# EasyEDA Pro project Excam多功能小相机.epro, board PCB1
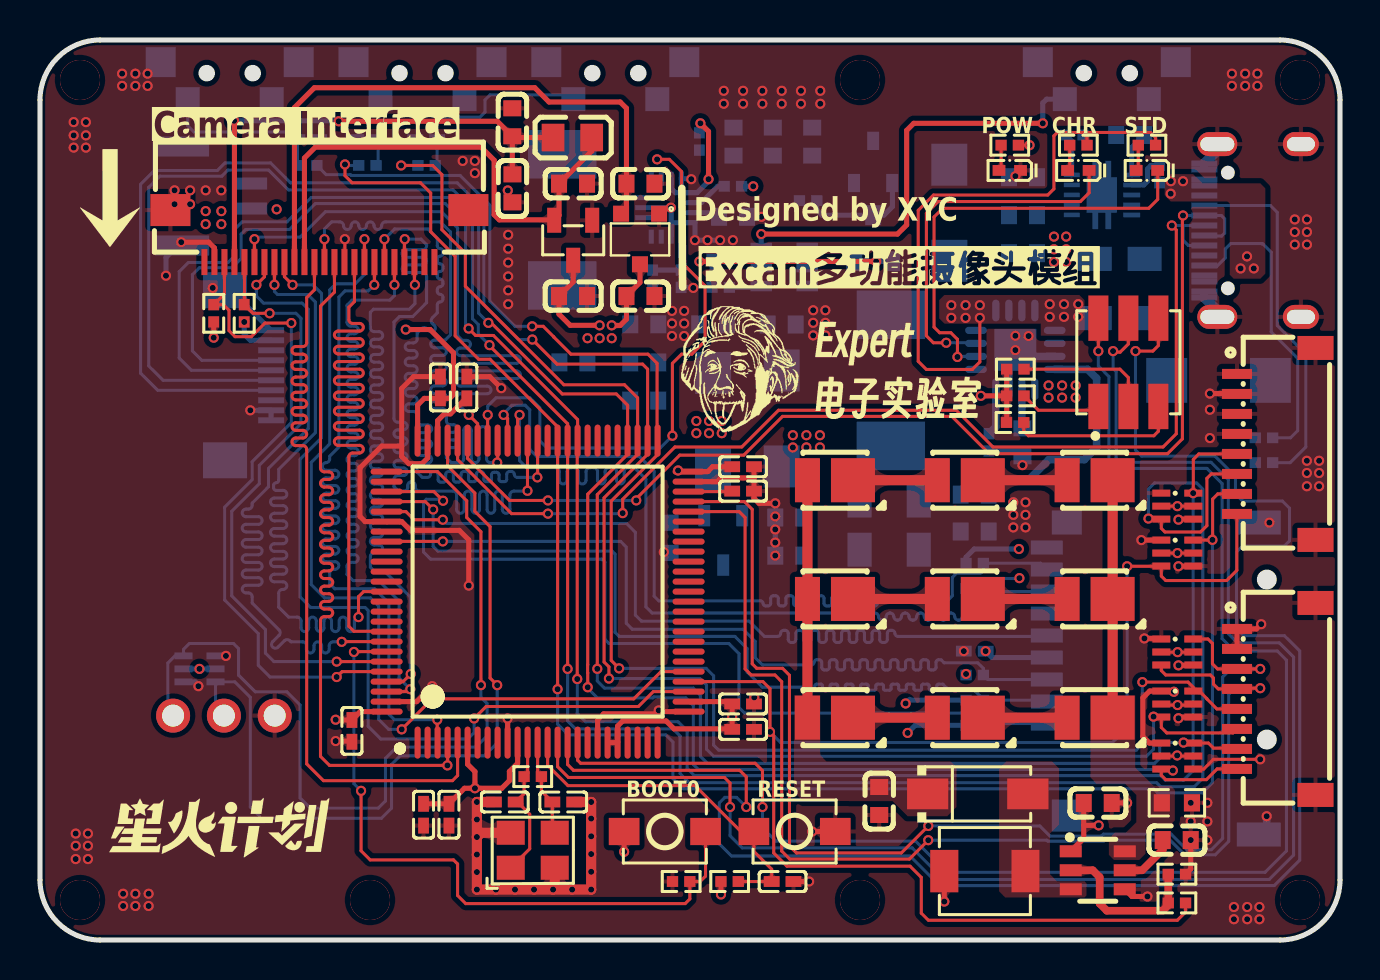
[diagram p4: board, top side]
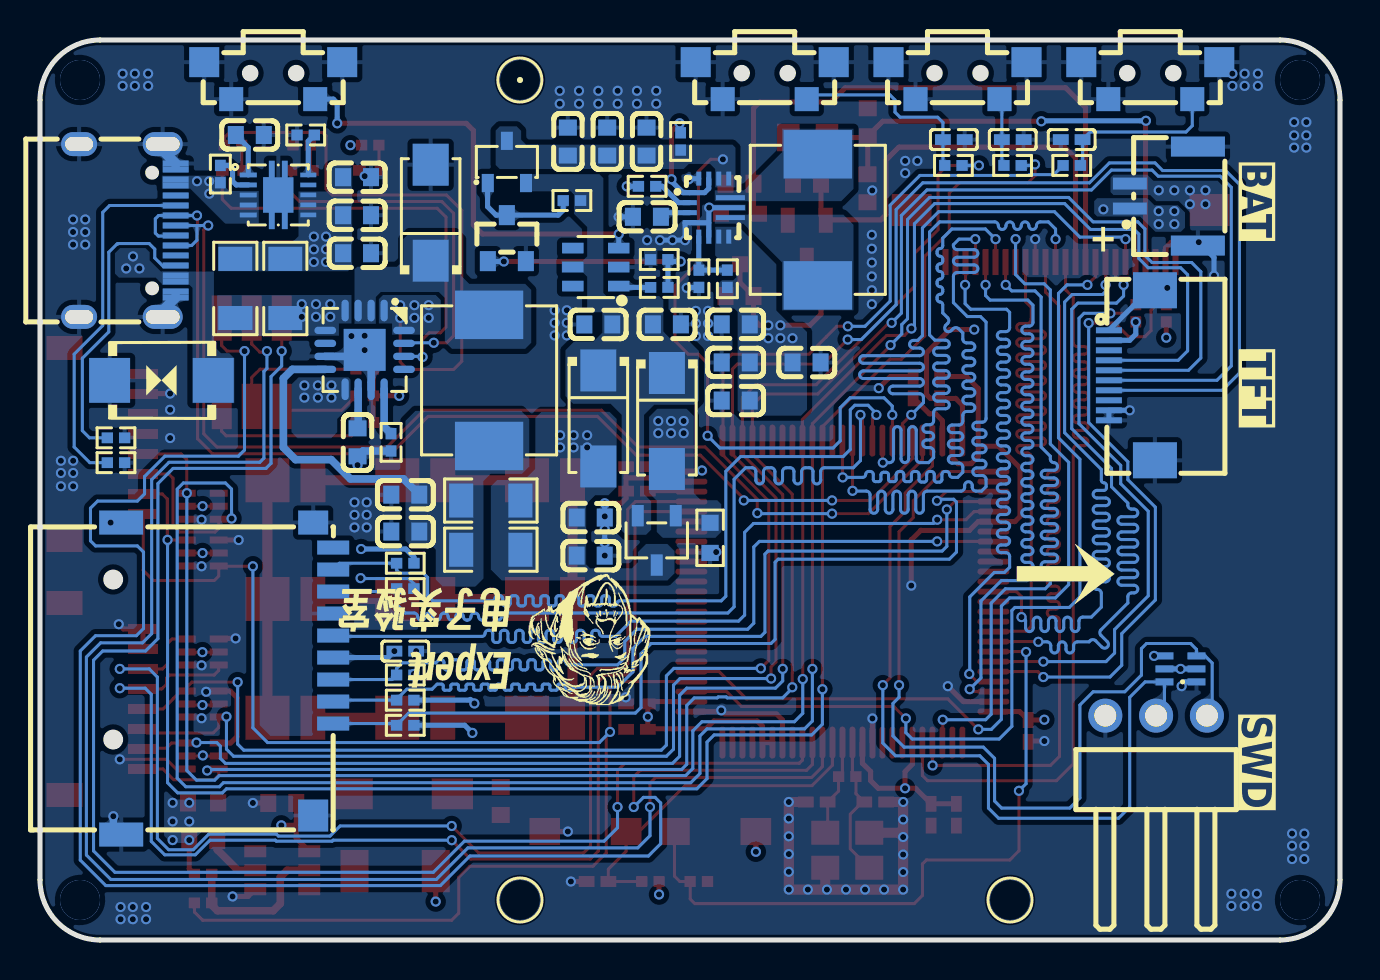
[diagram p5: board, bottom side, seen from below]

Outline 65 x 45 mm; copper layers: Top Layer, Inner1, Inner2, Bottom Layer. Coordinates in mm from the lower left corner of the outline.
Outline path: 0,42 0,3 arc(0.88,0.88) 3,0 62,0 arc(64.12,0.88) 65,3 65,42 arc(64.12,44.12) 62,45 3,45 arc(0.88,44.12) 0,42
Stack: Top Layer 0.035mm 外层铜厚1oz / Dielectric1 0.2104mm 7628 RC49% 8.6mil / Inner1 0.0152mm 内层铜厚 / Dielectric2 1.065mm 1.1mm H/HOZ Copper / Inner2 0.0152mm 内层铜厚 / Dielectric3 0.2104mm 7628 RC49% 8.6mil / Bottom Layer 0.035mm 外层铜厚1oz

## Design rules (mm)
net PA12: DP1
net PA11: DP1
template: 自定义配置
spacing copperThickness1oz (default): track to track 0.102, other pairs 0.152 to 0.3
spacing copperThickness2oz: track to track 0.203, other pairs 0.152 to 0.3
track width copperThickness1oz (default): min 0.127, default 0.152, max 2.54
track width copperThickness2oz: min 0.203, default 0.254, max 2.54
differential pair differentialPair (default): width min 0.127, default 0.254, max 2.54; gap min 0.152, default 0.152
via viaSize (default): diameter min 0.5, default 0.508, max 10; hole min 0.3, default 0.305, max 6.3

## Placement (name value [footprint] x y rotation side)
C1  4.7uF  [C0603]  52.89 6.85 180 top
C2  1uF  [C0603]  26.65 37.82 180 top
C3  1uF  [C0603]  41.96 6.95 90 top
C4  1uF  [C0603]  30.02 32.2 180 top
C5  1uF  [C0603]  26.65 32.2 180 top
C6  1uF  [C0603]  30.02 37.82 180 top
C8  10uF  [C0603]  23.62 37.58 90 top
C9  100nF  [C0603]  23.62 40.89 270 top
C114  100pF/NC  [C0603]  54.51 40.25 180 bottom
C115  10uF  [C0603]  46.74 20.42 0 bottom
C116  0.1uF  [C0603]  46.74 22.27 0 bottom
C117  10uF  [C0603]  49.15 36.24 0 bottom
C118  0.1uF  [C0603]  49.15 34.34 0 bottom
C119  10uF  [C0603]  49.15 38.14 0 bottom
C120  10uF  [C0603]  37.47 19.22 0 bottom
C121  0.1uF  [C0603]  37.46 21.12 0 bottom
C122  0.1uF  [C0603]  49.12 24.88 90 bottom
C136  10uF  [C0603]  36.64 39.92 270 bottom
C137  10uF  [C0603]  38.61 39.92 270 bottom
C138  10uF  [C0603]  34.67 39.92 270 bottom
C139  0.1uF  [C0603]  34.65 36.16 0 bottom
C140  10uF  [C0603]  30.21 26.97 180 bottom
C149  22uF  [C0603]  30.21 30.78 180 bottom
C150  22uF  [C0603]  26.67 28.88 0 bottom
C151  22uF  [C0603]  30.21 28.88 180 bottom
C152  100nF  [C0402]  19.18 6.27 270 top
C153  100nF  [C0402]  20.45 6.27 270 top
C154  100nF  [C0402]  35.15 11.8 0 top
C155  100nF  [C0402]  35.15 10.53 0 top
C156  2.2uF  [C0402]  35.15 22.44 180 top
C157  100nF  [C0402]  35.15 23.66 0 top
C158  22pF  [C0402]  23.24 6.9 0 top
C159  22pF  [C0402]  26.16 6.9 180 top
C160  1uF  [C0402]  37.13 2.92 180 top
C161  10uF  [C0603]  37.08 30.78 180 bottom
C162  0.1uF  [C0603]  33.66 30.78 0 bottom
C163  2.2uF  [C0402]  21.34 27.63 90 top
C164  100nF  [C0402]  20.02 27.63 90 top
C165  100nF  [C0402]  15.6 10.46 270 top
C166  100nF  [C0402]  46.74 14.44 0 bottom
C167  220nF  [C0603]  56.84 5 180 top
C168  1uF  [C0402]  13.42 40.02 180 bottom
C169  1uF  [C0402]  16.36 40.02 0 bottom
C170  1uF  [C0402]  19.31 40.02 0 bottom
CARD2  TF-012D  [TF-SMD_TF-012]  55.64 13.07 270 bottom
D1  SS54  [SMA_L4.4-W2.8-LS5.4-R-RD]  46.89 7.31 0 top
D22  SMBJ6.0CA  [SMB_L4.6-W3.6-LS5.3-BI]  58.93 27.98 180 bottom
FPC2  AFC01-S24FCA-00  [FPC-SMD_P0.50-24P_FGS-XJ-H2.0]  13.97 35.2 0 top
FPC4  F-FPC0M10P-C310  [FPC-SMD_P0.50-10P_FGS]  10.4 28.24 90 bottom
H3  KH-2.54PH90-1X3P-L13.8  [HDR-TH_3P-P2.54-H-M-W10.4-N]  9.19 11.22 180 bottom
L5  10uH  [IND-SMD_L7.3-W6.6]  42.54 27.98 270 bottom
L7  1.5uH  [IND-SMD_L7.3-W6.6]  26.11 36.01 90 bottom
L8  10uH  [IND-SMD_L4.4-W4.2]  47.24 3.45 0 top
L10  MPZ2012S300ATD25  [L0805]  26.62 40.12 180 top
LED1  LT2835WDT-6070-BKS  [LED-SMD_L3.5-W2.8-RD-A]  39.51 22.99 180 top
LED2  TC5050RGBF08-3CJH-AF53A  [LED-SMD_6P-L5.0-W5.0-TL_TC5050RGBF08]  54.42 28.88 90 top
LED5  LT2835WDT-6070-BKS  [LED-SMD_L3.5-W2.8-RD-A]  46 17.05 180 top
LED6  LT2835WDT-6070-BKS  [LED-SMD_L3.5-W2.8-RD-A]  52.49 17.05 180 top
LED7  LT2835WDT-6070-BKS  [LED-SMD_L3.5-W2.8-RD-A]  39.51 11.12 180 top
LED8  LT2835WDT-6070-BKS  [LED-SMD_L3.5-W2.8-RD-A]  46 11.12 180 top
LED9  -  [LED_0402]  55.35 38.48 180 top
LED10  -  [LED_0402]  51.92 38.48 180 top
LED11  -  [LED_0402]  48.49 38.48 180 top
LED12  LT2835WDT-6070-BKS  [LED-SMD_L3.5-W2.8-RD-A]  46 22.99 180 top
LED13  LT2835WDT-6070-BKS  [LED-SMD_L3.5-W2.8-RD-A]  52.49 22.99 180 top
LED14  LT2835WDT-6070-BKS  [LED-SMD_L3.5-W2.8-RD-A]  52.49 11.12 180 top
LED15  LT2835WDT-6070-BKS  [LED-SMD_L3.5-W2.8-RD-A]  39.51 17.05 180 top
Q1  -  [S8050_SOT-23]  41.78 35.09 270 bottom
Q3  AO3401  [SOT-23-3_L2.9-W1.4-P1.90-LS2.6-BR]  41.66 38.9 270 bottom
R1  1.1R  [R0603]  56.84 6.86 180 top
R111  1M  [R0402]  55.98 38.3 90 bottom
R112  100K  [R0402]  51.71 40.25 0 bottom
R113  5K  [R0402]  51.92 39.74 0 top
R114  5K  [R0402]  55.35 39.74 0 top
R115  320K  [R0402]  47.45 24.88 270 bottom
R116  0.4Ω  [R1206]  42.46 21.97 180 bottom
R117  0.4Ω  [R1206]  42.46 19.51 180 bottom
R119  10K  [R0402]  32.97 39.93 270 bottom
R120  100K  [R0402]  34.65 37.69 180 bottom
R121  150K  [R0402]  32.06 33.06 270 bottom
R122  470K  [R0402]  30.63 33.06 90 bottom
R125  10K  [R0603]  31.5 20.11 90 bottom
R126  2K  [R0402]  48.49 39.74 0 top
R128  0.4  [R1206]  52.74 32.58 270 bottom
R129  0.4  [R1206]  55.23 32.58 270 bottom
R130  1M  [R0402]  24.64 8.17 180 top
R131  10K  [R0402]  34.48 2.92 180 top
R132  10K  [R0402]  32.06 2.92 0 top
R135  470  [R0402]  48.77 27.21 180 top
R136  470  [R0402]  48.77 28.54 180 top
R137  470  [R0402]  48.76 25.88 180 top
R139  1K  [R0402]  34.04 32.63 180 bottom
R140  100K  [R0402]  34.04 34.03 0 bottom
R141  100K  [R0402]  38.41 36.97 180 bottom
R142  5.1K  [R0402]  61.2 23.87 180 bottom
R143  5.1K  [R0402]  61.2 25.11 180 bottom
R144  10K  [R0402]  46.74 18.84 180 bottom
R145  10K  [R0402]  46.74 17.57 180 bottom
R146  10K  [R0402]  46.74 13.25 180 bottom
R147  10K  [R0402]  46.74 11.99 180 bottom
R148  10K  [R0402]  46.74 10.74 180 bottom
R151  4.7K  [R0402]  8.69 31.33 270 top
R152  4.7K  [R0402]  10.21 31.33 270 top
R156  0  [R0402]  56.84 1.85 0 top
R157  10K  [R0402]  56.84 3.29 0 top
R159  0  [R0402]  13.41 38.73 0 bottom
R160  0  [R0402]  16.37 38.73 180 bottom
R161  0  [R0402]  19.33 38.73 180 bottom
SW1  按键3X6侧按键(带定位柱)  [SW-SMD_L7.0-W3.5-P4.20_C9900005441]  53.34 42.97 180 bottom
SW2  轻触按键3*4*H  [SW-SMD_L4.0-W2.9-LS5.0]  31.24 5.42 0 top
SW3  轻触按键3*4*H  [SW-SMD_L4.0-W2.9-LS5.0]  37.73 5.42 0 top
SW7  按键3X6侧按键(带定位柱)  [SW-SMD_L7.0-W3.5-P4.20_C9900005441]  9.49 42.97 180 bottom
SW8  按键3X6侧按键(带定位柱)  [SW-SMD_L7.0-W3.5-P4.20_C9900005441]  19.12 42.97 180 bottom
SW9  按键3X6侧按键(带定位柱)  [SW-SMD_L7.0-W3.5-P4.20_C9900005441]  28.76 42.97 180 bottom
U1  XC6206P282MR  [SOT-23-3_L2.9-W1.3-P1.90-LS2.4-BR]  26.66 34.99 90 top
U2  STM32H743VIT6  [LQFP-100_L14.0-W14.0-P0.50-LS16.0-BL]  24.88 17.42 0 top
U3  SS54  [SMA_L4.2-W2.6-LS5.1-RD]  33.66 25.95 270 bottom
U71  BAV99S  [SOT-363-6_L2.0-W1.3-P0.65-LS2.1-BL]  56.87 9.2 270 top
U83  BAV99S  [SOT-363-6_L2.0-W1.3-P0.65-LS2.1-BL]  56.87 14.4 270 top
U84  BAV99S  [SOT-363-6_L2.0-W1.3-P0.65-LS2.1-BL]  56.87 11.8 270 top
U85  BAV99S  [SOT-363-6_L2.0-W1.3-P0.65-LS2.1-BL]  56.87 19.35 270 top
U86  BAV99S  [SOT-363-6_L2.0-W1.3-P0.65-LS2.1-BL]  56.87 21.69 270 top
U95  TPS259261DRCR  [VSON-10_L3.0-W3.0-P0.50-TL-EP_TPS62410DRCR]  53.09 37.25 180 bottom
U96  TP5100  [TQFN-16_L4.0-W4.0-P0.65-BL-EP]  48.77 29.51 0 bottom
U98  AO3401  [SOT-23-3_L2.9-W1.6-P1.90-LS2.8-BR]  34.16 19.98 90 bottom
U99  SS54  [SMA_L4.2-W2.6-LS5.1-RD]  45.47 36.36 90 bottom
U100  SS54  [SMA_L4.2-W2.6-LS5.1-RD]  37.08 26.08 270 bottom
U101  TPS63070RNMR  [VQFN-HR-15_L3.0-W2.5-P0.50-BL_TPS63070RNMR]  31.5 36.62 270 bottom
U104  EC190708- 15FF-1925  [SOT-23-6_L2.9-W1.6-P0.95-LS2.9-BL]  37.21 33.65 90 bottom
U106  XC6206P182MR  [SOT-23-3L_L2.9-W1.6-P1.90-LS2.8-BL]  30 35.05 180 top
U108  SH1.0MM-8P-W  [CONN-SMD_8P-SH1.0MM-8P-W]  61.81 12.05 90 top
U109  SH1.0MM-8P-W  [CONN-SMD_8P-SH1.0MM-8P-W]  61.81 24.8 90 top
U110  TPS61165DBVR  [SOT-23-6_L2.9-W1.6-P0.95-LS2.8-BR]  52.89 3.49 180 top
U111  GH1.25-2P卧贴  [CONN-SMD_2P-P1.25_GH1.25-2P]  8.81 37.2 90 bottom
U112  BAV99S  [SOT-363-6_L2.0-W1.3-P0.65-LS2.1-BL]  7.98 13.56 90 bottom
USB2  KH-TYPE-C-16P  [USB-C-SMD_KH-TYPE-C-16P]  60.63 35.47 270 bottom
X1  12MHz  [OSC-SMD_4P-L3.2-W2.5-BL]  24.64 4.49 0 top

## Footprints (pads in the part's own frame, mm; a bottom-side part is the same pattern mirrored in y, then rotated)
C0402
  rect 0.79x0.54 smd: 1(-0.545,0) 2(0.545,0)
C0603
  rect 0.8x0.9 smd: 1(-0.7,0) 2(0.7,0)
CONN-SMD_2P-P1.25_GH1.25-2P
  rect 0.6x1.7 smd: 1(-0.625,1.702) 2(0.625,1.702)
  rect 1x2.7 smd: 3(2.475,-1.702) 4(-2.475,-1.698)
CONN-SMD_8P-SH1.0MM-8P-W
  rect 1.2x1.8 smd: 0(-4.799,-1.962) 0(4.799,-1.962)
  rect 0.5x1.5 smd: 1(3.5,1.962) 2(2.5,1.962) 3(1.5,1.962) 4(0.5,1.962) 5(-0.5,1.962) 6(-1.5,1.962) 7(-2.5,1.962) 8(-3.5,1.962)
FPC-SMD_P0.50-10P_FGS
  rect 0.3x1.3 smd: 1(2.25,1.149) 2(1.748,1.151) 3(1.248,1.151) 4(0.748,1.151) 5(0.248,1.151) 6(-0.252,1.151) 7(-0.752,1.151) 8(-1.252,1.151) 9(-1.752,1.151) 10(-2.252,1.151)
  rect 1.8x2.2 smd: 11(-4.25,-1.151) 12(4.25,-1.151)
FPC-SMD_P0.50-24P_FGS-XJ-H2.0
  rect 0.3x1.3 smd: 1(-5.748,-1.3) 2(-5.248,-1.3) 3(-4.748,-1.3) 4(-4.248,-1.3) 5(-3.748,-1.3) 6(-3.248,-1.3) 7(-2.748,-1.3) 8(-2.248,-1.3) 9(-1.748,-1.3) 10(-1.248,-1.3) 11(-0.748,-1.3) 12(-0.248,-1.3) 13(0.252,-1.3) 14(0.752,-1.3) 15(1.252,-1.3) 16(1.752,-1.3) 17(2.252,-1.3) 18(2.752,-1.3) 19(3.252,-1.3) 20(3.752,-1.3) 21(4.252,-1.3) 22(4.752,-1.3) 23(5.252,-1.3) 24(5.752,-1.3)
  rect 2x1.6 smd: 25(7.45,1.3) 26(-7.45,1.3)
HDR-TH_3P-P2.54-H-M-W10.4-N
  round 1.7 hole 1.1: 1(-2.54,0) 2(0,0) 3(2.54,0)
IND-SMD_L4.4-W4.2
  rect 1.4x2.12 smd: 1(2.028,0) 2(-2.028,0)
IND-SMD_L7.3-W6.6
  rect 2.424x3.42 smd: 1(3.278,0) 2(-3.278,0)
L0805
  rect 1.133x1.377 smd: 1(-0.966,0) 2(0.966,0)
LED-SMD_6P-L5.0-W5.0-TL_TC5050RGBF08
  rect 2.265x1 smd: 1(-2.208,1.5) 2(-2.208,0) 3(-2.208,-1.5) 4(2.208,-1.5) 5(2.208,0) 6(2.208,1.5)
LED-SMD_L3.5-W2.8-RD-A
  rect 2.2x2.2 smd: 1(-1.137,0)
  rect 1.25x2.2 smd: 2(1.137,0)
LED_0402
  rect 0.637x0.541 smd: 1(-0.538,0) 2(0.538,0)
LQFP-100_L14.0-W14.0-P0.50-LS16.0-BL
  oval 0.3x1.6 smd: 1(-6,-7.55) 2(-5.5,-7.55) 3(-5,-7.55) 4(-4.5,-7.55) 5(-4,-7.55) 6(-3.5,-7.55) 7(-3,-7.55) 8(-2.5,-7.55) 9(-2,-7.55) 10(-1.5,-7.55) 11(-1,-7.55) 12(-0.5,-7.55) 13(0,-7.55) 14(0.5,-7.55) 15(1,-7.55) 16(1.5,-7.55) 17(2,-7.55) 18(2.5,-7.55) 19(3,-7.55) 20(3.5,-7.55) 21(4,-7.55) 22(4.5,-7.55) 23(5,-7.55) 24(5.5,-7.55) 25(6,-7.55) 51(6,7.55) 52(5.5,7.55) 53(5,7.55) 54(4.5,7.55) 55(4,7.55) 56(3.5,7.55) 57(3,7.55) 58(2.5,7.55) 59(2,7.55) 60(1.5,7.55) 61(1,7.55) 62(0.5,7.55) 63(0,7.55) 64(-0.5,7.55) 65(-1,7.55) 66(-1.5,7.55) 67(-2,7.55) 68(-2.5,7.55) 69(-3,7.55) 70(-3.5,7.55) 71(-4,7.55) 72(-4.5,7.55) 73(-5,7.55) 74(-5.5,7.55) 75(-6,7.55)
  oval 1.6x0.3 smd: 26(7.55,-6) 27(7.55,-5.5) 28(7.55,-5) 29(7.55,-4.5) 30(7.55,-4) 31(7.55,-3.5) 32(7.55,-3) 33(7.55,-2.5) 34(7.55,-2) 35(7.55,-1.5) 36(7.55,-1) 37(7.55,-0.5) 38(7.55,0) 39(7.55,0.5) 40(7.55,1) 41(7.55,1.5) 42(7.55,2) 43(7.55,2.5) 44(7.55,3) 45(7.55,3.5) 46(7.55,4) 47(7.55,4.5) 48(7.55,5) 49(7.55,5.5) 50(7.55,6) 76(-7.55,6) 77(-7.55,5.5) 78(-7.55,5) 79(-7.55,4.5) 80(-7.55,4) 81(-7.55,3.5) 82(-7.55,3) 83(-7.55,2.5) 84(-7.55,2) 85(-7.55,1.5) 86(-7.55,1) 87(-7.55,0.5) 88(-7.55,0) 89(-7.55,-0.5) 90(-7.55,-1) 91(-7.55,-1.5) 92(-7.55,-2) 93(-7.55,-2.5) 94(-7.55,-3) 95(-7.55,-3.5) 96(-7.55,-4) 97(-7.55,-4.5) 98(-7.55,-5) 99(-7.55,-5.5) 100(-7.55,-6)
OSC-SMD_4P-L3.2-W2.5-BL
  rect 1.4x1.2 smd: 1(-1.1,-0.875) 2(1.1,-0.875) 3(1.1,0.875) 4(-1.1,0.875)
R0402
  rect 0.566x0.54 smd: 1(-0.433,0) 2(0.433,0)
R0603
  rect 0.806x0.864 smd: 1(-0.753,0) 2(0.753,0)
R1206
  rect 1.208x1.701 smd: 1(-1.479,0) 2(1.479,0)
S8050_SOT-23
  rect 1x0.8 smd: 1(1.15,-0.823) 2(1.15,1.077) 3(-1.15,0.127)
SMA_L4.2-W2.6-LS5.1-RD
  rect 2.1x1.8 smd: 1(-2.4,0) 2(2.4,0)
SMA_L4.4-W2.8-LS5.4-R-RD
  rect 2.062x1.539 smd: 1(2.503,0) 2(-2.503,0)
SMB_L4.6-W3.6-LS5.3-BI
  rect 2.047x2.241 smd: 1(-2.591,0) 2(2.591,0)
SOT-23-3_L2.9-W1.3-P1.90-LS2.4-BR
  rect 1.25x0.7 smd: 1(1,-0.95) 2(1,0.95) 3(-1,0)
SOT-23-3_L2.9-W1.4-P1.90-LS2.6-BR
  rect 0.91x0.6 smd: 1(1.055,-0.955) 2(1.055,0.955) 3(-1.055,0)
SOT-23-3_L2.9-W1.6-P1.90-LS2.8-BR
  rect 1.07x0.6 smd: 1(1.235,-0.95) 2(1.235,0.95) 3(-1.235,0)
SOT-23-3L_L2.9-W1.6-P1.90-LS2.8-BL
  rect 0.8x0.8 smd: 1(-0.95,-1.265) 2(0.95,-1.265) 3(0.005,1.265)
SOT-23-6_L2.9-W1.6-P0.95-LS2.8-BR
  rect 1.1x0.6 smd: 1(1.35,-0.95) 2(1.35,0) 3(1.35,0.95) 4(-1.35,0.95) 5(-1.35,0) 6(-1.35,-0.95)
SOT-23-6_L2.9-W1.6-P0.95-LS2.9-BL
  rect 0.532x1.072 smd: 1(-0.95,-1.149) 2(0,-1.149) 3(0.95,-1.149) 4(0.95,1.149) 5(0,1.149) 6(-0.95,1.149)
SOT-363-6_L2.0-W1.3-P0.65-LS2.1-BL
  rect 0.35x0.9 smd: 1(-0.65,-0.8) 2(0,-0.8) 3(0.65,-0.8) 4(0.65,0.8) 5(0,0.8) 6(-0.65,0.8)
SW-SMD_L4.0-W2.9-LS5.0
  rect 1.53x1.36 smd: 1(-2.035,0) 2(2.035,0)
SW-SMD_L7.0-W3.5-P4.20_C9900005441
  rect 1.2x1.2 smd: 1(-2.1,-0.925) 2(2.1,-0.925)
  rect 1.5x1.5 smd: 3(-3.45,0.925) 4(3.45,0.925)
TF-SMD_TF-012
  rect 0.7x1.6 smd: 1(2.25,5.3) 2(1.15,5.3) 3(0.05,5.3) 4(-1.05,5.3) 5(-2.15,5.3) 6(-3.25,5.3) 7(-4.35,5.3) 8(-5.45,5.3) CD(-6.55,5.3)
  rect 1.2x1.5 smd: 10(-7.8,4.3)
  rect 1.2x2.2 smd: 11(-7.8,-5.3) 12(7.8,-5.3)
  rect 1.6x1.5 smd: 13(6.85,4.3)
TQFN-16_L4.0-W4.0-P0.65-BL-EP
  oval 0.364x1.087 smd: 1(-0.975,-1.968) 2(-0.325,-1.968) 3(0.325,-1.968) 4(0.975,-1.968) 9(0.975,1.968) 10(0.325,1.968) 11(-0.325,1.968) 12(-0.975,1.968)
  oval 1.087x0.364 smd: 5(1.968,-0.975) 6(1.968,-0.325) 7(1.968,0.325) 8(1.968,0.975) 13(-1.968,0.975) 14(-1.968,0.325) 15(-1.968,-0.325) 16(-1.968,-0.975)
  rect 2.1x2.1 smd: 17(0,0)
USB-C-SMD_KH-TYPE-C-16P
  oval 1.2x2 hole 0.7x1.7: 1(-4.32,1.765) 2(4.32,1.765)
  oval 1.2x1.8 hole 0.7x1.4: 3(-4.32,-2.415) 4(4.32,-2.415)
  rect 0.3x1.3 smd: A1(-3.35,2.415) A4(-2.55,2.415) A5(-1.25,2.415) A6(-0.25,2.415) A7(0.25,2.415) A8(1.25,2.415) A9(2.55,2.415) A12(3.35,2.415) B1(3.05,2.415) B4(2.25,2.415) B5(1.75,2.415) B6(0.75,2.415) B7(-0.75,2.415) B8(-1.75,2.415) B9(-2.25,2.415) B12(-3.05,2.415)
VQFN-HR-15_L3.0-W2.5-P0.50-BL_TPS63070RNMR
  rect 0.25x0.7 smd: 1(-0.75,-1.016) 2(-0.25,-1.016) 3(0.25,-1.016) 4(0.75,-1.016)
  rect 0.7x0.25 smd: 5(1.45,-0.566) 6(1.45,-0.066) 7(1.45,0.434) 8(1.45,0.934) 12(-1.45,0.934) 13(-1.45,0.434) 14(-1.45,-0.066) 15(-1.45,-0.566)
  rect 0.25x1.45 smd: 9(0.5,1.016) 11(-0.5,1.016)
  rect 0.25x1.85 smd: 10(0,0.817)
VSON-10_L3.0-W3.0-P0.50-TL-EP_TPS62410DRCR
  rect 0.85x0.24 smd: 1(-1.5,1) 2(-1.5,0.5) 3(-1.5,0) 4(-1.5,-0.5) 5(-1.5,-1)
  rect 0.8x0.23 smd: 6(1.5,-1) 7(1.5,-0.5) 8(1.5,0) 9(1.5,0.5) 10(1.5,1)
  custom 1.52x3.42 smd: 11(0,-0.005)

## Nets
1.8V: C6.2 FPC2.10 U106.2
2.8V-A: C8.2 C9.2 FPC2.4 L10.2
2.8V-D: C2.2 FPC2.11 L10.1 U1.2
3V3: C1.2 C4.2 C5.2 C140.2 C149.2 C150.2 C151.2 C152.1 C153.1 C154.1 C155.1 C157.1 C164.1 C165.1 C166.2 CARD2.4 FPC4.2 L8.2 R120.1 R122.1 R126.2 R131.2 R135.2 R136.2 R137.2 R144.2 R145.2 R146.2 R147.2 R148.2 R151.2 R152.2 SW2.1 U1.3 U2.6 U2.11 U2.20 U2.21 U2.27 U2.50 U2.75 U2.100 U71.2 U71.5 U83.2 U83.5 U84.2 U84.5 U85.2 U85.5 U86.2 U86.5 U101.7 U101.8 U106.3 U110.1 U112.2 U112.5
GND: C1.1 C2.1 C3.1 C4.1 C5.1 C6.1 C8.1 C9.1 C114.2 C115.2 C116.2 C117.1 C118.1 C119.1 C120.1 C121.1 C122.1 C136.1 C137.1 C138.1 C139.2 C140.1 C149.1 C150.1 C151.1 C152.2 C153.2 C154.2 C155.2 C156.1 C157.2 C158.1 C159.1 C160.1 C161.1 C162.1 C163.2 C164.2 C165.2 C166.1 C167.1 C168.1 C169.1 C170.1 CARD2.6 CARD2.10 CARD2.11 CARD2.12 CARD2.13 D22.1 FPC2.2 FPC2.15 FPC2.25 FPC2.26 FPC4.1 FPC4.9 FPC4.10 FPC4.11 FPC4.12 H3.1 LED11.1 Q1.2 R1.1 R112.2 R115.2 R121.2 R125.1 R132.1 R140.2 R142.2 R143.2 R157.2 SW1.1 SW1.3 SW1.4 SW3.2 SW7.1 SW7.3 SW7.4 SW8.1 SW8.3 SW8.4 SW9.1 SW9.3 SW9.4 U1.1 U2.10 U2.19 U2.26 U2.49 U2.74 U2.81 U2.99 U71.1 U71.4 U83.1 U83.4 U84.1 U84.4 U85.1 U85.4 U86.1 U86.4 U95.11 U96.7 U96.11 U96.17 U99.2 U101.4 U101.6 U101.10 U101.15 U104.2 U106.1 U108.0 U108.1 U108.2 U109.0 U109.1 U109.2 U109.3 U109.4 U110.4 U111.2 U111.3 U111.4 U112.1 U112.4 USB2.1 USB2.2 USB2.3 USB2.4 USB2.A1 USB2.A12 USB2.B1 USB2.B12 X1.2 X1.4
VBUS: C117.2 C118.2 C119.2 R125.2 R128.1 R129.1 U3.2 U95.6 U95.7 U95.8 U98.1
VIN: C136.2 C137.2 C138.2 Q3.3 R119.2 U2.68 U101.12 U101.13
VIN_BAT: C161.2 C162.2 Q3.2 R141.2 U3.1 U98.2 U100.1 U104.5
BAT: C120.2 C121.2 R116.2 R117.2 U96.9 U98.3 U100.2 U111.1
BOOT0: R132.2 SW2.2 U2.94
CC1: R142.1 USB2.A5
CC2: R143.1 USB2.B5
DAC: R156.2 U2.29 U85.3 U109.8
DCMI_CLK: FPC2.13 U2.67
DCMI_D0: FPC2.19 U2.63
DCMI_D1: FPC2.21 U2.64
DCMI_D2: FPC2.22 U2.97
DCMI_D3: FPC2.20 U2.98
DCMI_D4: FPC2.18 U2.3
DCMI_D5: FPC2.16 U2.92
DCMI_D6: FPC2.14 U2.4
DCMI_D7: FPC2.12 U2.5
DCMI_HSYNC: FPC2.9 U2.28
DCMI_PCLK: FPC2.17 U2.30
DCMI_PWDN: FPC2.8 U2.88
DCMI_RST: FPC2.6 U2.69
DCMI_VSYNC: FPC2.7 U2.93
I2C1_SCL: FPC2.5 R152.1 U2.95
I2C1_SDA: FPC2.3 R151.1 U2.96
I2C2_SCL: U2.46 U83.3 U108.4
I2C2_SDA: U2.47 U83.6 U108.3
IN: C3.2 D1.2 LED1.2 LED7.2 LED15.2
LED_B: LED2.6 U2.17
LED_G: LED2.4 U2.16
LED_R: LED2.5 U2.15
OSC_IN: C158.2 R130.2 U2.12 X1.1
OSC_OUT: C159.2 R130.1 U2.13 X1.3
OUT: LED6.1 LED13.1 LED14.1 R1.2 U110.6
PA11: U2.70 USB2.A7 USB2.B7
PA12: U2.71 USB2.A6 USB2.B6
PA13: H3.2 U2.72 U112.6
PA14: H3.3 U2.76 U112.3
PB12: R159.2 U2.51 U84.6 U108.5
PB13: FPC4.7 U2.52 U84.3 U108.6
PB14: R161.2 U2.53 U71.6 U108.7
PB15: FPC4.6 U2.54 U71.3 U108.8
PC8: CARD2.7 R145.1 U2.65
PC9: CARD2.8 R144.1 U2.66
PC10: CARD2.1 R148.1 U2.78
PC11: CARD2.2 R147.1 U2.79
PC12: CARD2.5 U2.80
PD2: CARD2.3 R146.1 U2.83
PD12: FPC4.4 U2.59 U86.6 U109.5
PD13: FPC4.5 U2.60 U86.3 U109.6
PD14: R160.2 U2.61 U85.6 U109.7
RESET: C160.2 R131.1 SW3.1 U2.14
USBVIN: D22.2 R111.1 U95.3 U95.4 U95.5 USB2.A4 USB2.A9 USB2.B4 USB2.B9
$1N3549: C163.1 U2.73
$1N3580: C156.2 U2.48
$1N3744: LED2.1 R135.1
$1N3745: LED2.2 R136.1
$1N3746: LED2.3 R137.1
$1N4459: R111.2 U95.2
$1N4460: C114.1 U95.1
$1N4462: R112.1 U95.10
$1N5190: LED10.1 U96.15
$1N5191: LED9.1 U96.14
$1N5192: LED10.2 R113.1
$1N5193: LED9.2 R114.1
$1N5198: L5.2 U96.2 U96.3 U99.1
$1N5199: C115.1 C116.1 L5.1 R116.1 R117.1 U96.8
$1N5204: R115.1 U96.12
$1N5206: C122.2 U96.10
$1N5210: R113.2 R114.2 R128.2 R129.2 U96.1 U96.4 U96.5 U96.16
$1N5785: L7.1 U101.11
$1N5786: L7.2 U101.9
$1N5790: R119.1 U101.1 U101.14
$1N5793: C139.1 U101.3
$1N5797: R120.2 U101.2
$1N5798: R121.1 R122.2 U101.5
$1N5799: LED11.2 R126.1
$1N7002: Q1.1 R139.2 R140.1
$1N7003: R139.1 U104.1
$1N7007: Q1.3 Q3.1 R141.1
$1N9964: SW1.2 U104.3
$1N32732: C167.2 U110.5
$1N32737: LED1.1 LED12.2
$1N32738: LED7.1 LED8.2
$1N32739: LED12.1 LED13.2
$1N32741: LED8.1 LED14.2
$1N32745: LED5.2 LED15.1
$1N32746: LED5.1 LED6.2
$1N39545: R156.1 R157.1 U110.2
$1N39592: D1.1 L8.1 U110.3
$1N42854: C168.2 R159.1 SW7.2
$1N42887: C169.2 R160.1 SW8.2
$1N42920: C170.2 R161.1 SW9.2

Pads without a net: CARD2 CD; FPC2 1 23 24; FPC4 3 8; U2 1 2 7 8 9 18 22 23 24 25 31 32 33 34 35 36 37 38 39 40 41 42 43 44 45 55 56 57 58 62 77 82 84 85 86 87 89 90 91; U95 9; U96 6 13; U104 4 6; USB2 A8 B8

## Via types
v1: diameter 2, hole 2, Top Layer to Bottom Layer, 7 vias
v2: diameter 0.508, hole 0.305, Top Layer to Bottom Layer, 336 vias

## Routing (per net, layer and track width the routed paths; a pad name or vN(x,y) marks a point on that pad's centre or on a via; arc(x,y) is an arc through that point)
1.8V: length 30.5
  Top Layer w0.254: FPC2.10 12.72,41.62 13.72,42.61 24.74,42.61 25.45,41.9 29.01,41.9 29.32,41.58 C6.2 29.32,36.58 U106.2
2.8V-A: length 25.3
  Top Layer w0.254: L10.2 23.68,40.12 C9.2 ; v2(14.94,40.94) 22.87,40.94 C9.2 ; C9.2 23.62,38.29 C8.2 ; FPC2.4 9.72,40.94 v2(9.7,40.96)
  Bottom Layer w0.254: v2(9.7,40.96) 14.91,40.96 v2(14.94,40.94)
2.8V-D: length 25.9
  Top Layer w0.254: 27.59,40.12 27.59,39.45 C2.2 25.95,36.23 U1.2 25.69,36.01 22.96,36.01 22.71,36.26 22.71,38.99 22.05,39.64 13.77,39.64 13.22,39.1 FPC2.11
3V3: length 82.8
  Top Layer w0.152: U83.2 56.07,14.39 v2(56.88,14.39) 57.66,14.39 U83.5 ; U86.2 U86.5 ; U71.2 U71.5 ; U84.5 57.62,11.75 v2(56.88,11.75) 56.12,11.75 U84.2 ; U85.5 v2(56.87,19.35) U85.2 ; R126.2 v2(49.48,39.74)
  Top Layer w0.254: v2(18.29,30.52) 19.51,30.52 20.68,29.35 20.68,27.27 20.49,27.08 C164.1 19.22,27.08 18.88,26.75 U2.75 ; U2.100 16.01,11.42 C165.1 14.8,11 v2(14.78,11.02) ; C1.2 52.19,5.75 ; 52.19,5.75 52.2,5.73 v2(52.93,5.73) ; 52.19,5.75 52.19,5.09 U110.1 ; U2.11 23.88,8.83 23.47,8.42 23.47,7.97 23.09,7.59 v2(21.75,7.59) ; v2(21.75,7.59) 21.22,7.59 C153.1 C152.1 ; v2(21.75,7.59) 21.75,8.42 21.38,8.79 U2.6 ; U2.20 U2.21 28.88,10.69 29.13,10.95 31.31,10.95 31.7,10.56 34.58,10.56 C155.1 v2(34.61,11.16) C154.1 34.49,11.92 U2.27 ; U106.3 30,32.87 C4.2 29.32,31.04 29.01,30.72 28.59,30.72 v2(28.59,30.73) ; R136.2 R135.2 ; R135.2 48.34,25.89 R137.2 ; R135.2 v2(47.04,27.21) ; R131.2 v2(34.05,2.28) ; U2.50 33.39,23.42 33.63,23.66 C157.1 ; L8.2 v2(45.22,1.92) ; SW2.1 v2(29.21,4.41) ; U1.3 26.66,32.91 C5.2 25.95,31.29 26.51,30.73 v2(27.98,30.73) ; R151.2 v2(8.69,30.12)
  Bottom Layer w0.152: R145.2 46.3,17.81 46.56,18.07 48.95,18.07 v2(48.97,18.09)
  Bottom Layer w0.254: v2(43.38,10.35) 43.76,10.74 R148.2 ; v2(10.21,30.9) 10.21,30.29 10.52,29.98 11.56,29.98 ; R144.2 46.3,19.14 46.71,19.55 v2(48.95,19.55) ; R147.2 43.45,11.99 ; 43.49,12.03 v2(43.28,11.83) ; v2(47.28,14.44) 47.6,14.12 CARD2.4 ; R120.1 v2(35.66,37.69) ; U112.2 v2(7.97,13.56) U112.5
  vias: v2(27.38,30.09) v2(27.98,30.09) v2(28.59,30.09) v2(31.9,23.48) v2(46.3,13.3) v2(56.87,21.69) v2(56.86,9.23)
GND: length 111.9
  Top Layer w0.152: FPC2.15 15.24,33.91 v2(15.24,35.04) ; U71.4 58.19,8.55 58.67,9.03 v2(61.01,9.03)
  Top Layer w0.254: 18.09,24.69 18.09,24.17 18.44,23.82 19.1,23.82 19.38,24.1 U2.74 ; 18.09,24.69 17.08,24.69 16,23.61 16,21.17 16.26,20.92 U2.81 18.09,20.92 18.53,20.48 20.96,20.48 21.44,20.01 v2(21.44,17.72) ; 18.09,24.69 18.09,27.58 18.68,28.17 C164.2 ; 35.7,23.11 C156.1 35.7,22.09 35.95,21.83 v2(36.76,21.83) ; 35.7,23.11 C157.2 ; 35.7,23.11 34.04,23.11 33.85,22.92 U2.49 ; SW3.2 v2(38.61,5.42) ; FPC2.2 8.72,34.6 8.43,34.89 v2(7.06,34.89) ; C1.1 v2(54.36,6.85) ; v2(56.92,11.09) 56.98,11.15 U84.4 ; C160.1 v2(38.46,2.92) ; U2.26 31,11.42 v2(30.94,11.48) 30.76,11.31 28.18,11.31 27.88,11.01 U2.19 ; v2(23.06,27.59) 22.48,28.17 C163.2 ; U86.4 56.9,21.04 ; v2(19.61,12.69) 18.84,11.92 U2.99 ; v2(57.54,5) 57.54,3.55 R157.2 ; U71.1 55.47,9.85 55.14,10.18 55.14,12.11 55.49,12.45 U84.1 56.66,12.45 v2(56.69,12.41) ; U85.4 57.66,18.69 v2(56.92,18.69) ; v2(14.78,9.95) 15.56,9.95 C165.2 ; v2(61.06,15.79) 60.82,15.55 U108.1 U108.2 ; U85.1 v2(55.07,20) ; v2(55.22,15.08) 56.04,15.08 U83.1 ; v2(56.92,13.73) 57.65,13.73 U83.4 ; v2(23.38,11.08) U2.10 ; v2(58.5,27.32) 59.83,27.32 U109.2 ; U110.4 54.6,2.18 v2(55.37,2.18)
  Top Layer w0.508: C159.1 v2(27.56,6.9) v2(27.56,6.07) v2(27.56,5.19) v2(27.56,4.3) v2(27.56,3.41) v2(27.56,2.52) v2(26.61,2.52) v2(25.65,2.52) ; v2(21.84,5.15) v2(21.84,4.27) v2(21.84,3.4) v2(21.84,2.52) v2(22.8,2.52) v2(23.75,2.52) v2(24.7,2.52) v2(25.65,2.52) ; v2(21.84,5.15) 22.06,5.36 X1.4 ; v2(21.84,5.15) v2(21.84,6.02) v2(21.84,6.9) C158.1 ; v2(25.65,2.52) 25.74,2.61 X1.2
  Bottom Layer w0.254: 36.76,19.22 36.76,21.83 v2(36.76,21.83) ; 8.78,14.2 v2(9.3,14.2) ; v2(34,34.99) v2(33.38,34.99) v2(32.75,34.99) 32.75,35.87 U101.4 31.56,35.87 ; FPC4.12 9.55,32.49 11.55,30.49 ; v2(6.3,33.21) 6.3,34.13 v2(7.06,34.89) ; U101.6 31.56,35.87 ; 31.56,35.87 31.56,36.6 v2(31.54,36.62) ; U112.1 7.76,12.91 7.98,12.69 ; U101.15 32.53,38.07 v2(32.56,38.04) ; 11.56,25.98 11.56,26.48 v2(10.52,26.48) ; R121.2 32.64,32.63 v2(32.66,32.61) ; C139.2 36.07,36.16 v2(36.07,36.16)
  Bottom Layer w0.381: C122.1 48.86,24.45 R115.2 ; U96.11 48.44,29.14 48.77,29.47 49.05,29.18 U96.7 ; CARD2.12 61.33,5.67 v2(61.33,6.19)
  Bottom Layer w0.508: USB2.2 58.87,31.47 USB2.A12 ; 58.87,39.8 58.87,39.47 USB2.A1
  vias: v2(1.68,40.89) v2(1.68,40.23) v2(1.68,39.62) v2(1.78,5.32) v2(1.78,4.71) v2(1.78,4.05) v2(2.3,40.89) v2(2.3,40.23) v2(2.3,39.62) v2(2.4,5.32) v2(2.4,4.71) v2(2.4,4.05) v2(4.11,43.32) v2(4.11,42.7) v2(4.16,2.31) v2(4.16,1.7) v2(4.77,43.32) v2(4.77,42.7) v2(4.77,2.31) v2(4.77,1.7) v2(5.38,43.32) v2(5.38,42.7) v2(5.43,2.31) v2(5.43,1.7) v2(6.73,37.48) v2(6.73,36.79) v2(7.5,37.48) v2(7.5,36.79) v2(7.92,12.69) v2(8.28,37.48) v2(8.64,32.61) v2(9.06,37.48) v2(21.13,38.95) v2(21.74,38.95) v2(21.74,38.34) v2(23.39,37.48) v2(23.41,35.26) v2(23.41,34.57) v2(23.41,33.87) v2(23.41,33.18) v2(23.41,32.48) v2(23.41,31.79) v2(31.19,19.4) v2(31.6,31.46) v2(31.6,30.83) v2(31.6,30.2) v2(32.21,31.46) v2(32.21,30.83) v2(32.21,30.2) v2(34.19,42.46) v2(34.19,41.81) v2(34.65,34.99) v2(35.15,42.46) v2(35.15,41.81) v2(35.71,12.13) v2(36.12,42.46) v2(36.12,41.81) v2(36.76,21.18) v2(36.76,20.53) v2(36.76,19.87) v2(36.76,19.22) v2(37.08,42.46) v2(37.08,41.81) v2(38.05,42.46) v2(38.05,41.81) v2(38.66,31.49) v2(38.66,30.86) v2(38.66,30.23) v2(39.01,42.46) v2(39.01,41.81) v2(39.27,31.49) v2(39.27,30.86) v2(39.27,30.23) v2(46.19,14.44) v2(48.67,21.89) v2(48.67,21.26) v2(48.67,20.63) v2(48.77,38.19) v2(48.77,30.21) v2(48.77,29.49) v2(49.12,23.74) v2(49.28,21.89) v2(49.28,21.26) v2(49.28,20.63) v2(49.43,30.2) v2(56.92,21.02) v2(57.54,6.86) v2(57.54,5.93) v2(58.37,6.86) v2(58.37,5.93) v2(58.37,5) v2(58.5,26.51) v2(58.5,25.1) v2(59.59,43.32) v2(59.59,42.7) v2(59.7,1.65) v2(59.7,1.04) v2(60.26,43.32) v2(60.26,42.7) v2(60.36,1.65) v2(60.36,1.04) v2(60.87,43.32) v2(60.87,42.7) v2(60.97,1.65) v2(60.97,1.04) v2(61.47,20.87) v2(62.74,36.03) v2(62.74,35.4) v2(62.74,34.77) v2(63.35,36.03) v2(63.35,35.4) v2(63.35,34.77) v2(63.34,23.96) v2(63.34,23.35) v2(63.34,22.69) v2(63.96,23.96) v2(63.96,23.35) v2(63.96,22.69)
VBUS:
  vias: v2(32.82,25.95) v2(32.82,25.34) v2(33.45,25.95) v2(33.45,25.34) v2(34.09,25.95) v2(34.09,25.34) v2(50.7,35.17) v2(50.7,34.53) v2(50.7,33.9) v2(51.31,35.17) v2(51.31,34.53) v2(51.31,33.9)
VIN: length 29.5
  Top Layer w0.152: U2.68 22.38,26.25 v2(22.39,26.25) ; v2(30.86,39.03) 31.47,39.03 32.08,38.42 32.08,33.88 33.25,32.71 33.25,29.95 32.59,29.29 32.08,29.29 31.62,28.83 v2(31.62,25.21)
  Bottom Layer w0.152: v2(31.62,25.21) 31.01,24.6 25.35,24.6 24.99,24.96 24.99,26.61 24.49,27.11 22.8,27.11 22.39,26.69 v2(22.39,26.25)
(no net):
  vias: v1(2,43) v1(2,2) v1(16.5,2) v1(41,43) v1(41,2) v1(63,43) v1(63,2)
BAT:
  vias: v2(8.28,36.44) v2(8.28,35.79) v2(9.07,36.44) v2(9.07,35.79) v2(11.83,36.53) v2(37.64,25.24) v2(37.64,24.63) v2(38.32,25.24) v2(38.32,24.63) v2(39,25.24) v2(39,24.63) v2(50.43,27.73) v2(50.43,27.12) v2(51.1,27.73) v2(51.1,27.12) v2(51.78,27.73) v2(51.78,27.12)
BOOT0: length 34.3
  Top Layer w0.152: v2(16.05,7.46) 16.05,4.46 16.51,4 20.68,4 20.88,3.8 20.88,2.23 21.28,1.82 32.26,1.82 32.49,2.05 R132.2 33.01,2.92 33.28,3.19 SW2.2 ; U2.94 15.72,14.42 v2(15.7,14.4)
  Bottom Layer w0.152: v2(15.7,14.4) 15.7,7.81 v2(16.05,7.46)
CC1: length 18.1
  Bottom Layer w0.152: 61.66,23.87 62.51,23.87 63.29,24.65 63.29,29.29 61.86,30.72 61.86,36.38 61.52,36.72 USB2.A5
CC2: length 15.2
  Bottom Layer w0.152: R143.1 62.53,25.11 62.88,25.47 62.88,29.08 61.56,30.41 61.56,34.39 61.15,34.8 61.12,34.8 61.09,34.82 59.54,34.82 59.26,34.55 59.26,34.1 58.83,33.67 58.27,33.67 USB2.B5
DAC: length 71.7
  Top Layer w0.152: R156.2 57.28,1.4 56.87,0.99 44.42,0.99 44.06,1.34 44.06,3.13 43.5,3.69 37.35,3.69 36.69,4.35 36.69,10.22 v2(36.5,10.41) 36.5,12.56 36.14,12.92 U2.29 ; U109.8 59.84,21.3 59.84,18.48 59.33,17.97 56.29,17.97 56.07,18.19 U85.3 56.06,18.69 v2(54.36,18.69)
  Bottom Layer w0.152: v2(36.5,10.41) 37.03,9.87 53.62,9.87 54.36,10.61 v2(54.36,18.69)
DCMI_CLK: length 39.1
  Top Layer w0.152: U2.67 22.88,23.89 v2(22.86,23.87) ; FPC2.13 v2(14.22,35.04)
  Bottom Layer w0.152: v2(22.86,23.87) 22.52,23.87 arc(22.38,23.92) 22.33,24.06 22.33,25.48 arc(22.14,25.67) 21.95,25.48 21.95,24.06 arc(21.76,23.87) 21.57,24.06 21.57,25.48 arc(21.38,25.67) 21.19,25.48 21.19,24.06 arc(21.13,23.92) 21,23.87 20.57,23.87 20.32,24.12 20.32,24.43 arc(20.38,24.57) 20.51,24.62 20.67,24.62 arc(20.86,24.81) 20.67,25 20.51,25 arc(20.32,25.19) 20.51,25.38 20.67,25.38 arc(20.86,25.57) 20.67,25.76 20.51,25.76 arc(20.38,25.82) 20.32,25.95 20.32,26.37 arc(20.26,26.51) 20.13,26.56 19.72,26.56 arc(19.53,26.75) 19.72,26.94 20.13,26.94 arc(20.32,27.13) 20.13,27.32 19.72,27.32 arc(19.53,27.52) 19.72,27.71 20.13,27.71 arc(20.32,27.9) 20.13,28.09 19.72,28.09 arc(19.53,28.28) 19.72,28.47 20.13,28.47 arc(20.32,28.66) 20.13,28.85 19.72,28.85 arc(19.53,29.04) 19.72,29.23 20.13,29.23 arc(20.32,29.42) 20.13,29.61 19.72,29.61 arc(19.53,29.8) 19.72,29.99 20.26,29.99 20.52,30.25 20.52,35.4 20.02,35.91 17.27,35.91 arc(17.14,35.85) 17.08,35.72 arc(16.89,35.53) 16.7,35.72 arc(16.51,35.91) 16.32,35.72 arc(16.13,35.53) 15.94,35.72 arc(15.75,35.91) 15.56,35.72 arc(15.37,35.53) 15.18,35.72 arc(15.12,35.85) 14.99,35.91 14.58,35.91 14.22,35.55 v2(14.22,35.04)
DCMI_D0: length 38.4
  Top Layer w0.152: U2.63 24.88,23.14 v2(24.87,23.13) ; FPC2.19 v2(17.22,35.04)
  Bottom Layer w0.152: v2(24.87,23.13) 23.86,23.13 arc(23.76,23.17) 23.72,23.28 arc(23.67,23.38) 23.57,23.43 23.48,23.43 arc(23.38,23.38) 23.34,23.28 23.34,23.03 arc(23.3,22.95) 23.23,22.92 23.06,22.92 arc(22.98,22.95) 22.95,23.03 22.95,23.26 arc(22.92,23.35) 22.83,23.39 22.7,23.39 arc(22.61,23.35) 22.57,23.26 22.57,23.03 arc(22.54,22.95) 22.47,22.92 22.3,22.92 arc(22.22,22.95) 22.19,23.03 22.19,23.28 arc(22.15,23.38) 22.04,23.43 21.96,23.43 arc(21.85,23.38) 21.81,23.28 21.81,23.03 arc(21.78,22.95) 21.7,22.92 21.54,22.92 arc(21.46,22.95) 21.43,23.03 21.43,23.28 arc(21.39,23.38) 21.28,23.43 21.2,23.43 arc(21.09,23.38) 21.05,23.28 21.05,23.01 arc(21.01,22.93) 20.93,22.9 20.78,22.9 arc(20.7,22.93) 20.67,23.01 20.67,23.28 arc(20.62,23.38) 20.52,23.43 20.43,23.43 arc(20.33,23.38) 20.29,23.28 20.29,23.01 arc(20.25,22.93) 20.17,22.89 20.02,22.89 arc(19.94,22.93) 19.91,23.01 19.91,23.28 arc(19.86,23.38) 19.76,23.43 19.67,23.43 arc(19.57,23.38) 19.53,23.28 arc(19.48,23.17) 19.38,23.13 19.12,23.13 18.86,23.39 18.86,23.65 arc(18.92,23.79) 19.05,23.84 19.39,23.84 arc(19.58,24.03) 19.39,24.22 19.05,24.22 arc(18.86,24.42) 19.05,24.61 19.39,24.61 arc(19.58,24.8) 19.39,24.99 19.05,24.99 arc(18.86,25.18) 19.05,25.37 19.39,25.37 arc(19.58,25.56) 19.39,25.75 19.05,25.75 arc(18.92,25.8) 18.86,25.94 18.86,26.24 arc(18.8,26.37) 18.67,26.43 18.45,26.43 arc(18.26,26.62) 18.45,26.81 18.67,26.81 arc(18.86,27) 18.67,27.19 18.45,27.19 arc(18.26,27.38) 18.45,27.57 18.67,27.57 arc(18.86,27.76) 18.67,27.95 18.45,27.95 arc(18.26,28.14) 18.45,28.33 18.67,28.33 arc(18.86,28.52) 18.67,28.71 18.45,28.71 arc(18.26,28.9) 18.45,29.09 18.67,29.09 arc(18.86,29.28) 18.67,29.47 18.45,29.47 arc(18.26,29.66) 18.45,29.86 18.67,29.86 arc(18.8,29.91) 18.86,30.05 18.86,30.35 19.07,30.57 arc(19.21,30.62) 19.34,30.57 19.44,30.47 arc(19.71,30.47) 19.71,30.74 19.61,30.84 arc(19.56,30.97) 19.61,31.11 19.86,31.36 19.86,31.76 arc(19.9,31.86) 20,31.9 arc(20.1,31.94) 20.15,32.04 20.15,32.14 arc(20.1,32.24) 20,32.28 arc(19.9,32.33) 19.86,32.42 19.86,32.52 arc(19.9,32.62) 20,32.67 arc(20.1,32.71) 20.15,32.81 20.15,32.9 arc(20.1,33) 20,33.05 arc(19.9,33.09) 19.86,33.19 19.86,33.29 arc(19.9,33.39) 20,33.43 arc(20.1,33.47) 20.15,33.57 20.15,33.67 arc(20.1,33.77) 20,33.81 arc(19.9,33.85) 19.86,33.95 19.86,34.05 arc(19.9,34.15) 20,34.19 arc(20.1,34.23) 20.15,34.33 20.15,34.43 arc(20.1,34.53) 20,34.57 arc(19.9,34.61) 19.86,34.71 19.86,35.09 19.41,35.55 17.73,35.55 v2(17.22,35.04)
DCMI_D1: length 41.2
  Top Layer w0.152: FPC2.21 18.22,35.03 v2(18.24,35.04) ; v2(24.37,22.46) 24.37,24.96 U2.64
  Bottom Layer w0.152: v2(18.24,35.04) 19.05,35.04 19.33,34.76 19.33,34.71 arc(19.27,34.57) 19.14,34.52 18.3,34.52 arc(18.1,34.33) 18.3,34.14 19.14,34.14 arc(19.33,33.95) 19.14,33.76 18.3,33.76 arc(18.1,33.57) 18.3,33.38 19.14,33.38 arc(19.27,33.32) 19.33,33.18 19.33,31.87 18.63,31.17 17.97,31.17 17.7,30.9 17.7,26.08 arc(17.75,25.94) 17.89,25.89 18.17,25.89 arc(18.36,25.7) 18.17,25.51 17.89,25.51 arc(17.7,25.32) 17.89,25.13 18.17,25.13 arc(18.36,24.94) 18.17,24.75 17.89,24.75 arc(17.7,24.56) 17.89,24.36 18.17,24.36 arc(18.36,24.17) 18.17,23.98 17.89,23.98 arc(17.7,23.79) 17.89,23.6 18.17,23.6 arc(18.36,23.41) 18.17,23.22 17.89,23.22 arc(17.75,23.17) 17.7,23.03 17.7,22.67 17.92,22.44 18.2,22.44 arc(18.33,22.5) 18.39,22.64 18.39,22.73 arc(18.58,22.92) 18.77,22.73 18.77,22.64 arc(18.82,22.5) 18.96,22.44 20.64,22.44 arc(20.77,22.39) 20.83,22.25 20.83,21.53 arc(21.02,21.34) 21.21,21.53 21.21,22.25 arc(21.4,22.44) 21.59,22.25 21.59,21.53 arc(21.78,21.34) 21.97,21.53 21.97,22.25 arc(22.16,22.44) 22.35,22.25 22.35,21.53 arc(22.54,21.34) 22.74,21.53 22.74,22.25 arc(22.93,22.44) 23.12,22.25 23.12,21.53 arc(23.31,21.34) 23.5,21.53 23.5,22.25 arc(23.55,22.39) 23.69,22.44 24.36,22.44 v2(24.37,22.46)
DCMI_D2: length 38.7
  Top Layer w0.152: v2(18.75,32.76) 18.72,32.78 FPC2.22 ; U2.97 18.16,12.92 v2(18.54,13.3)
  Bottom Layer w0.152: v2(18.75,32.76) 18.75,31.82 18.47,31.54 16.67,31.54 16.52,31.39 16.52,30.61 arc(16.57,30.47) 16.71,30.42 16.95,30.42 arc(17.14,30.23) 16.95,30.04 16.71,30.04 arc(16.52,29.85) 16.71,29.66 16.95,29.66 arc(17.14,29.47) 16.95,29.28 16.71,29.28 arc(16.52,29.08) 16.71,28.89 16.95,28.89 arc(17.14,28.7) 16.95,28.51 16.71,28.51 arc(16.52,28.32) 16.71,28.13 16.95,28.13 arc(17.14,27.94) 16.95,27.75 16.71,27.75 arc(16.52,27.56) 16.71,27.37 16.95,27.37 arc(17.14,27.18) 16.95,26.99 16.71,26.99 arc(16.52,26.8) 16.71,26.61 16.95,26.61 arc(17.14,26.42) 16.95,26.23 16.71,26.23 arc(16.52,26.04) 16.71,25.85 16.95,25.85 arc(17.14,25.66) 16.95,25.47 16.71,25.47 arc(16.52,25.28) 16.71,25.08 16.95,25.08 arc(17.14,24.89) 16.95,24.7 16.71,24.7 arc(16.52,24.51) 16.71,24.32 16.95,24.32 arc(17.14,24.13) 16.95,23.94 16.71,23.94 arc(16.52,23.75) 16.71,23.56 16.95,23.56 arc(17.14,23.37) 16.95,23.18 16.71,23.18 arc(16.52,22.99) 16.71,22.8 16.95,22.8 arc(17.14,22.61) 16.95,22.42 16.71,22.42 arc(16.52,22.23) 16.71,22.04 16.95,22.04 arc(17.14,21.85) 16.95,21.66 16.71,21.66 arc(16.52,21.47) 16.71,21.27 16.95,21.27 arc(17.14,21.08) 16.95,20.89 16.71,20.89 arc(16.52,20.7) 16.71,20.51 16.95,20.51 arc(17.14,20.32) 16.95,20.13 16.71,20.13 arc(16.52,19.94) 16.71,19.75 16.95,19.75 arc(17.14,19.56) 16.95,19.37 16.71,19.37 arc(16.57,19.31) 16.52,19.18 16.52,18.64 16.78,18.38 17.29,18.38 18.51,17.15 18.51,13.32 v2(18.54,13.3)
DCMI_D3: length 39.5
  Top Layer w0.152: U2.98 18.4,12.42 v2(18.52,12.54) ; FPC2.20 v2(17.72,32.76)
  Bottom Layer w0.152: v2(17.72,32.76) 17.72,32.22 17.49,32 15.61,32 15.35,31.74 15.35,30.88 arc(15.41,30.75) 15.54,30.69 15.72,30.69 arc(15.91,30.5) 15.72,30.31 15.54,30.31 arc(15.35,30.12) 15.54,29.93 15.72,29.93 arc(15.91,29.74) 15.72,29.55 15.54,29.55 arc(15.35,29.36) 15.54,29.17 15.72,29.17 arc(15.91,28.98) 15.72,28.79 15.54,28.79 arc(15.35,28.6) 15.54,28.41 15.72,28.41 arc(15.91,28.22) 15.72,28.03 15.54,28.03 arc(15.35,27.84) 15.54,27.64 15.72,27.64 arc(15.91,27.45) 15.72,27.26 15.54,27.26 arc(15.35,27.07) 15.54,26.88 15.72,26.88 arc(15.91,26.69) 15.72,26.5 15.54,26.5 arc(15.35,26.31) 15.54,26.12 15.72,26.12 arc(15.91,25.93) 15.72,25.74 15.54,25.74 arc(15.35,25.55) 15.54,25.36 15.72,25.36 arc(15.91,25.17) 15.72,24.98 15.54,24.98 arc(15.35,24.79) 15.54,24.6 15.72,24.6 arc(15.91,24.41) 15.72,24.22 15.54,24.22 arc(15.35,24.03) 15.54,23.83 15.72,23.83 arc(15.91,23.64) 15.72,23.45 15.54,23.45 arc(15.35,23.26) 15.54,23.07 15.72,23.07 arc(15.91,22.88) 15.72,22.69 15.54,22.69 arc(15.35,22.5) 15.54,22.31 15.72,22.31 arc(15.91,22.12) 15.72,21.93 15.54,21.93 arc(15.35,21.74) 15.54,21.55 15.72,21.55 arc(15.91,21.36) 15.72,21.17 15.54,21.17 arc(15.35,20.98) 15.54,20.79 15.72,20.79 arc(15.91,20.6) 15.72,20.41 15.54,20.41 arc(15.35,20.22) 15.54,20.03 15.72,20.03 arc(15.91,19.83) 15.72,19.64 15.54,19.64 arc(15.35,19.45) 15.54,19.26 15.72,19.26 arc(15.91,19.07) 15.72,18.88 15.54,18.88 arc(15.41,18.83) 15.35,18.69 15.35,18.28 15.66,17.97 16.93,17.97 17.95,16.95 17.95,13.1 v2(18.52,12.54)
DCMI_D4: length 39.3
  Top Layer w0.152: U2.3 19.86,9.89 v2(19.86,11.01) ; FPC2.18 16.72,32.77 v2(16.71,32.76)
  Bottom Layer w0.152: v2(16.71,32.76) 16.41,32.45 15.25,32.45 14.94,32.15 14.94,24.65 14.48,24.19 14.48,24.05 arc(14.43,23.92) 14.31,23.87 arc(14.18,23.81) 14.13,23.69 14.13,23.66 arc(14.18,23.54) 14.31,23.49 14.75,23.49 arc(14.94,23.3) 14.75,23.11 14.31,23.11 arc(14.18,23.05) 14.13,22.93 14.13,22.9 arc(14.18,22.78) 14.31,22.72 14.75,22.72 arc(14.94,22.53) 14.75,22.34 14.31,22.34 arc(14.18,22.29) 14.13,22.16 14.13,22.14 arc(14.18,22.01) 14.31,21.96 14.75,21.96 arc(14.94,21.77) 14.75,21.58 14.31,21.58 arc(14.18,21.53) 14.13,21.4 14.13,21.38 arc(14.18,21.25) 14.31,21.2 14.75,21.2 arc(14.94,21.01) 14.75,20.82 14.31,20.82 arc(14.18,20.77) 14.13,20.64 14.13,20.62 arc(14.18,20.49) 14.31,20.44 14.75,20.44 arc(14.94,20.25) 14.75,20.06 14.31,20.06 arc(14.18,20) 14.13,19.88 14.13,19.85 arc(14.18,19.73) 14.31,19.68 14.75,19.68 arc(14.94,19.49) 14.75,19.3 14.31,19.3 arc(14.18,19.24) 14.13,19.12 14.13,19.09 arc(14.18,18.97) 14.31,18.91 14.75,18.91 arc(14.94,18.72) 14.75,18.53 14.67,18.53 arc(14.54,18.48) 14.48,18.34 14.48,17.82 14.74,17.56 16.73,17.56 17.44,16.85 17.44,11.29 17.72,11.01 v2(19.86,11.01)
DCMI_D5: length 42
  Top Layer w0.152: U2.92 17.32,15.43 15.69,15.43 15.44,15.68 15.44,24.16 arc(15.5,24.3) 15.63,24.35 15.98,24.35 arc(16.17,24.54) 15.98,24.73 14.91,24.73 arc(14.72,24.92) 14.91,25.11 15.98,25.11 arc(16.17,25.3) 15.98,25.49 14.91,25.49 arc(14.72,25.68) 14.91,25.88 15.98,25.88 arc(16.17,26.07) 15.98,26.26 14.91,26.26 arc(14.72,26.45) 14.91,26.64 15.98,26.64 arc(16.17,26.83) 15.98,27.02 14.91,27.02 arc(14.72,27.21) 14.91,27.4 15.98,27.4 arc(16.17,27.59) 15.98,27.78 14.91,27.78 arc(14.72,27.97) 14.91,28.16 15.98,28.16 arc(16.17,28.35) 15.98,28.54 14.91,28.54 arc(14.72,28.73) 14.91,28.92 15.98,28.92 arc(16.17,29.11) 15.98,29.3 14.91,29.3 arc(14.72,29.49) 14.91,29.69 15.98,29.69 arc(16.17,29.88) 15.98,30.07 14.91,30.07 arc(14.72,30.26) 14.91,30.45 15.98,30.45 arc(16.17,30.64) 15.98,30.83 15.63,30.83 arc(15.5,30.88) 15.44,31.02 15.44,31.64 15.72,31.92 FPC2.16
DCMI_D6: length 41.6
  Top Layer w0.152: FPC2.14 14.72,32.39 14.03,31.69 14.03,23.6 arc(14.08,23.46) 14.22,23.41 14.45,23.41 arc(14.64,23.22) 14.45,23.03 14.22,23.03 arc(14.03,22.84) 14.22,22.65 14.45,22.65 arc(14.64,22.46) 14.45,22.27 14.22,22.27 arc(14.03,22.07) 14.22,21.88 14.45,21.88 arc(14.64,21.69) 14.45,21.5 14.22,21.5 arc(14.03,21.31) 14.22,21.12 14.45,21.12 arc(14.64,20.93) 14.45,20.74 14.22,20.74 arc(14.03,20.55) 14.22,20.36 14.45,20.36 arc(14.64,20.17) 14.45,19.98 14.22,19.98 arc(14.03,19.79) 14.22,19.6 14.45,19.6 arc(14.64,19.41) 14.45,19.22 14.22,19.22 arc(14.03,19.03) 14.22,18.84 14.45,18.84 arc(14.64,18.65) 14.45,18.45 14.22,18.45 arc(14.03,18.26) 14.22,18.07 14.45,18.07 arc(14.64,17.88) 14.45,17.69 14.22,17.69 arc(14.03,17.5) 14.22,17.31 14.45,17.31 arc(14.64,17.12) 14.45,16.93 14.22,16.93 arc(14.03,16.74) 14.22,16.55 14.45,16.55 arc(14.64,16.36) 14.45,16.17 14.22,16.17 arc(14.08,16.11) 14.03,15.98 14.03,9.18 14.48,8.73 v2(20.37,8.73) 20.38,8.74 U2.4
DCMI_D7: length 42.9
  Top Layer w0.152: U2.5 20.88,8.22 20.62,7.97 14.17,7.97 13.33,8.81 13.33,24.53 arc(13.28,24.66) 13.14,24.72 12.79,24.72 arc(12.6,24.91) 12.79,25.1 13.14,25.1 arc(13.33,25.29) 13.14,25.48 12.79,25.48 arc(12.6,25.67) 12.79,25.86 13.14,25.86 arc(13.33,26.05) 13.14,26.24 12.79,26.24 arc(12.6,26.43) 12.79,26.62 13.14,26.62 arc(13.33,26.81) 13.14,27 12.79,27 arc(12.6,27.2) 12.79,27.39 13.14,27.39 arc(13.33,27.58) 13.14,27.77 12.79,27.77 arc(12.6,27.96) 12.79,28.15 13.14,28.15 arc(13.33,28.34) 13.14,28.53 12.79,28.53 arc(12.6,28.72) 12.79,28.91 13.14,28.91 arc(13.33,29.1) 13.14,29.29 12.79,29.29 arc(12.6,29.48) 12.79,29.67 13.14,29.67 arc(13.28,29.73) 13.33,29.86 13.33,32.12 13.72,32.51 FPC2.12
DCMI_HSYNC: length 45.7
  Top Layer w0.152: U2.28 30.67,12.42 29.92,11.67 22.31,11.67 v2(21.71,11.08) ; FPC2.9 12.22,33.16 v2(12.63,32.76)
  Bottom Layer w0.152: v2(21.71,11.08) 21.71,10.37 21.39,10.05 17.04,10.05 16.41,10.68 16.41,16.47 16.25,16.63 13.53,16.63 13,17.15 13,24.04 14.08,25.11 14.08,32.33 13.65,32.76 v2(12.63,32.76)
DCMI_PCLK: length 46.5
  Top Layer w0.152: v2(18.08,10.53) 19.61,12.06 29.69,12.06 31.05,13.42 U2.30 ; FPC2.17 v2(16.22,35.04)
  Bottom Layer w0.152: v2(18.08,10.53) 17.43,10.53 16.93,11.03 16.93,16.69 16.52,17.1 14.23,17.1 13.57,17.77 13.57,23.89 14.48,24.8 14.48,32.5 14.79,32.81 15.76,32.81 16.22,33.27 v2(16.22,35.04)
DCMI_PWDN: length 39.7
  Top Layer w0.152: v2(15.93,16.14) 15.93,17.17 16.18,17.42 U2.88 ; FPC2.8 v2(11.72,32.76)
  Bottom Layer w0.152: v2(11.72,32.76) 11.72,32.43 11.87,32.28 13.39,32.28 13.77,31.9 13.77,25.36 11.93,23.53 11.93,22.99 arc(11.9,22.9) 11.81,22.86 arc(11.72,22.82) 11.68,22.73 11.68,22.61 arc(11.72,22.52) 11.81,22.48 12.15,22.48 arc(12.34,22.29) 12.15,22.1 11.72,22.1 arc(11.53,21.91) 11.72,21.72 12.15,21.72 arc(12.34,21.53) 12.15,21.34 11.72,21.34 arc(11.53,21.15) 11.72,20.96 12.15,20.96 arc(12.34,20.77) 12.15,20.58 11.72,20.58 arc(11.53,20.38) 11.72,20.19 12.15,20.19 arc(12.34,20) 12.15,19.81 11.72,19.81 arc(11.53,19.62) 11.72,19.43 12.15,19.43 arc(12.34,19.24) 12.15,19.05 11.72,19.05 arc(11.53,18.86) 11.72,18.67 12.15,18.67 arc(12.34,18.48) 12.15,18.29 11.72,18.29 arc(11.53,18.1) 11.72,17.91 12.15,17.91 arc(12.34,17.72) 12.15,17.53 12.12,17.53 arc(11.99,17.47) 11.93,17.34 11.93,16.64 12.43,16.14 12.86,16.14 arc(13,16.09) 13.05,15.95 13.05,15.61 arc(13.24,15.42) 13.43,15.61 13.43,15.95 arc(13.62,16.14) 13.82,15.95 13.82,15.61 arc(14.01,15.42) 14.2,15.61 14.2,15.95 arc(14.39,16.14) 14.58,15.95 14.58,15.61 arc(14.77,15.42) 14.96,15.61 14.96,15.95 arc(15.15,16.14) 15.34,15.95 15.34,15.61 arc(15.53,15.42) 15.72,15.61 15.72,15.95 arc(15.78,16.09) 15.91,16.14 v2(15.93,16.14)
DCMI_RST: length 39.5
  Top Layer w0.152: v2(21.44,26.25) 21.88,25.81 U2.69 ; FPC2.6 v2(10.72,35.04)
  Bottom Layer w0.152: v2(10.72,35.04) 10.82,35.14 13,35.14 14.28,36.42 20.07,36.42 20.88,35.6 20.88,30.22 21.12,29.98 21.33,29.98 arc(21.52,29.79) 21.33,29.6 21.02,29.6 arc(20.83,29.41) 21.02,29.22 23.83,29.22 arc(24.02,29.03) 23.83,28.84 21.02,28.84 arc(20.83,28.65) 21.02,28.45 23.83,28.45 arc(24.02,28.26) 23.83,28.07 21.02,28.07 arc(20.83,27.88) 21.02,27.69 22.36,27.69 arc(22.55,27.5) 22.36,27.31 21.02,27.31 arc(20.88,27.26) 20.83,27.12 20.83,26.86 v2(21.44,26.25)
DCMI_VSYNC: length 40
  Top Layer w0.152: U2.93 15.1,14.92 v2(15.09,14.91) ; v2(10.82,32.76) 11.22,33.16 FPC2.7
  Bottom Layer w0.152: v2(15.09,14.91) 14.65,14.91 arc(14.52,14.85) 14.46,14.72 14.46,14.54 arc(14.27,14.35) 14.08,14.54 14.08,14.72 arc(13.89,14.91) 13.7,14.72 13.7,14.54 arc(13.51,14.35) 13.32,14.54 13.32,14.72 arc(13.26,14.85) 13.13,14.91 12.55,14.91 12.49,14.97 arc(12.36,15.02) 12.22,14.97 11.91,14.65 arc(11.64,14.65) 11.64,14.92 11.95,15.23 arc(12.01,15.37) 11.95,15.5 10.61,16.85 10.61,17.17 arc(10.55,17.3) 10.42,17.36 10.3,17.36 arc(10.11,17.55) 10.3,17.74 10.92,17.74 arc(11.11,17.93) 10.92,18.12 10.3,18.12 arc(10.11,18.31) 10.3,18.5 10.92,18.5 arc(11.11,18.69) 10.92,18.88 10.3,18.88 arc(10.11,19.07) 10.3,19.26 10.92,19.26 arc(11.11,19.45) 10.92,19.64 10.3,19.64 arc(10.11,19.83) 10.3,20.02 10.92,20.02 arc(11.11,20.21) 10.92,20.4 10.3,20.4 arc(10.11,20.59) 10.3,20.78 10.92,20.78 arc(11.11,20.97) 10.92,21.17 10.3,21.17 arc(10.11,21.36) 10.3,21.55 10.42,21.55 arc(10.55,21.6) 10.61,21.74 10.61,21.85 11.42,22.66 11.42,23.58 13.41,25.57 13.41,31.54 13.11,31.84 11.18,31.84 10.82,32.2 v2(10.82,32.76)
I2C1_SCL: length 30.4
  Top Layer w0.152: U2.95 v2(14.83,13.92) ; v2(11.48,31.33) 10.65,31.33 10.58,31.41 10.57,31.41 R152.1 10.22,31.78 FPC2.5
  Bottom Layer w0.152: v2(11.48,31.33) 12.8,31.33 13.05,31.08 13.05,25.82 10.97,23.73 10.97,22.81 9.59,21.44 9.59,17.2 11.27,15.52 11.27,14.35 11.7,13.92 v2(14.83,13.92)
I2C1_SDA: length 33.7
  Top Layer w0.152: v2(14.83,13.15) 15.1,13.42 U2.96 ; FPC2.3 9.22,32.3 R151.1 9.17,31.77 9.45,31.49 9.45,30.47 9.75,30.17 10.57,30.17 11.25,30.85 v2(12.57,30.85)
  Bottom Layer w0.152: v2(12.57,30.85) 12.57,25.87 10.61,23.92 10.61,23.02 9.23,21.64 9.23,17 10.91,15.32 10.91,13.74 11.5,13.15 v2(14.83,13.15)
I2C2_SCL: length 59.5
  Top Layer w0.152: v2(44.41,4.99) 43.47,4.05 37.49,4.05 37.08,4.45 37.08,12.91 36.75,13.25 35.56,13.25 35.25,13.56 35.25,21.12 34.96,21.42 U2.46 ; v2(61.01,12.59) 59.89,12.59 U108.4 58.91,12.55 58.67,12.79 58.67,13.1 58.52,13.25 56.29,13.25 56.07,13.47 U83.3
  Bottom Layer w0.152: v2(61.01,12.59) 59.74,12.59 59.44,12.28 59.44,4.93 58.76,4.26 57.23,4.26 56.5,4.99 53.23,4.99 53.18,4.94 50.39,4.94 50.34,4.99 v2(44.41,4.99)
I2C2_SDA: length 59.5
  Top Layer w0.152: U108.3 58.88,13.55 58.62,13.81 58.62,14.83 58.4,15.05 U83.6 ; v2(44.42,5.7) 43.07,4.35 37.82,4.35 37.47,4.7 37.47,13.24 37.13,13.58 35.84,13.58 35.61,13.81 35.61,21.53 35.22,21.92 U2.47 ; v2(61.01,13.56) 59.85,13.56
  Bottom Layer w0.152: v2(44.42,5.7) 49.99,5.7 50.5,5.2 53.08,5.2 53.18,5.29 56.56,5.29 57.34,4.51 58.57,4.51 59.13,5.08 59.13,13.15 59.54,13.56 v2(61.01,13.56)
IN: length 11.9
  Top Layer w0.508: LED1.2 LED15.2 LED7.2
LED_B: length 75.3
  Top Layer w0.152: U2.17 26.88,8.99 27.03,8.84 35.75,8.84 36.12,8.47 v2(36.12,6.65) ; LED2.6 v2(52.92,29.44)
  Bottom Layer w0.152: v2(36.12,6.65) 36.12,5.61 36.79,4.94 43.78,4.94 45.34,3.38 61.25,3.38 62.32,4.45 62.32,13.99 61.86,14.45 59.72,14.45 59.1,15.07 59.1,22.82 58.34,23.58 53.7,23.58 53.45,23.83 53.45,28.17 52.92,28.7 v2(52.92,29.44)
LED_G: length 85.3
  Top Layer w0.152: 35.29,6.65 35.29,6.64 ; v2(54.77,29.44) 55.64,29.44 55.92,29.72 LED2.4 ; v2(35.31,6.65) 35.31,8.16 34.99,8.48 26.67,8.48 26.38,8.78 U2.16
  Bottom Layer w0.152: v2(35.31,6.65) 34.83,7.13 34.25,7.13 33.97,6.85 33.97,4.81 34.58,4.2 43.5,4.2 44.98,2.72 61.71,2.72 62.99,4 62.99,14.45 62.22,15.22 60.18,15.22 59.82,15.57 59.82,19.4 60.13,19.7 62.22,19.7 62.48,19.96 62.48,21.59 62.12,21.95 60.13,21.95 59.77,22.3 59.77,23.17 58.75,24.19 55.08,24.19 54.77,24.5 v2(54.77,29.44)
LED_R: length 77.4
  Top Layer w0.152: LED2.5 54.42,29.8 54.01,29.39 53.65,29.39 ; v2(34.5,6.65) 34.5,7.85 34.22,8.13 26.42,8.13 25.88,8.67 U2.15
  Bottom Layer w0.152: v2(34.5,6.65) 34.5,5.21 35.11,4.61 43.61,4.61 45.19,3.03 61.46,3.03 62.68,4.25 62.68,14.15 61.97,14.86 59.88,14.86 59.42,15.32 59.42,23.02 58.55,23.89 54.01,23.89 53.81,24.09 53.81,28.42 53.65,28.58 53.65,29.39
  vias: v2(53.65,29.44)
OSC_IN: length 7.2
  Top Layer w0.152: U2.12 24.38,8.34 R130.2 24.21,7.32 C158.2 23.88,6.9 24.49,6.29 24.49,4.56 X1.1
OSC_OUT: length 4.9
  Top Layer w0.152: X1.3 25.62,5.48 25.62,6.9 25.07,7.45 R130.1 24.88,8.36 U2.13
OUT: length 11.9
  Top Layer w0.508: LED13.1 LED6.1 LED14.1
PA11: length 55.5
  Top Layer w0.152: v2(25.4,21.98) 23.48,21.98 21.38,24.08 U2.70 ; v2(57.15,36.22) 57.12,36.2 57.12,25.06 56.38,24.32 47.46,24.32 45.59,26.18 37.13,26.18 35.19,24.24 31.99,24.24 29.81,22.07 v2(29.81,21.98)
  Bottom Layer w0.152: USB2.A7 58.24,35.2 59.08,35.2 59.23,35.35 59.23,36.06 59.07,36.22 USB2.B7 v2(57.15,36.22) ; v2(29.81,21.98) v2(25.4,21.98)
PA12: length 55.6
  Top Layer w0.152: U2.71 20.88,24.02 23.58,21.32 v2(25.4,21.32) ; v2(56.59,35.72) 56.81,35.5 56.81,25.31 56.15,24.65 47.65,24.65 45.81,26.49 36.92,26.49 35.09,24.65 31.75,24.65 29.13,22.04 v2(29.13,21.34)
  Bottom Layer w0.152: USB2.A6 57.15,35.72 ; 57.15,35.72 57.15,34.99 57.42,34.72 USB2.B6 ; 57.15,35.72 v2(56.59,35.72) ; v2(29.13,21.34) 29.11,21.32 v2(25.4,21.32)
PA13: length 41
  Top Layer w0.152: U2.72 20.38,23.71 21.74,22.34 21.74,21.43 22.5,20.67 22.5,13.1 v2(22.86,12.74)
  Bottom Layer w0.152: v2(22.86,12.74) 22.86,9.85 22.22,9.21 18.01,9.21 17.58,8.78 17.58,6.59 17.07,6.09 11.07,6.09 10.52,6.65 10.52,12.13 9.74,12.91 U112.6 8.78,11.64 H3.2
PA14: length 45.7
  Top Layer w0.152: U2.76 19.88,23.42 21.34,21.96 21.34,21.12 22.05,20.41 v2(22.05,12.74)
  Bottom Layer w0.152: v2(22.05,12.74) 22.05,12.13 22.35,11.83 22.35,10.2 21.79,9.64 17.83,9.64 17.27,9.08 17.27,6.95 16.92,6.59 13.51,6.59 13,7.1 13,11.75 12.34,12.41 10.76,12.41 9.93,13.24 9.93,14.57 9.67,14.83 7.47,14.83 7.18,14.53 7.18,14.2 6.75,14.2 6.39,13.85 6.39,11.48 6.66,11.22
PB12: length 78.7
  Top Layer w0.152: U84.6 57.96,12.45 58.34,12.07 58.34,12.05 58.84,11.55 U108.5 ; v2(24.61,30.68) 25.16,30.68 25.69,30.15 25.69,30.15 26.54,29.29 30.4,29.29 30.86,28.83 30.86,24.99 U2.51 30.88,24.27 28.56,21.95 28.56,13.98 v2(28.96,13.58) ; 57.68,12.61 57.4,12.89 v2(55.12,12.89)
  Bottom Layer w0.152: v2(24.61,30.68) 23.75,30.68 22.49,31.94 22.49,36.74 21,38.23 15.56,38.23 15.52,38.27 14.31,38.27 R159.2 ; v2(55.12,12.89) 55.12,9.8 54.81,9.49 33.93,9.49 33.68,9.75 33.68,13.21 33.31,13.58 v2(28.96,13.58)
PB13: length 103
  Top Layer w0.152: v2(24.62,30.02) 25.84,28.8 30.13,28.8 30.38,28.54 U2.52 30.38,24.28 28.2,22.11 28.2,13.9 28.45,13.66 v2(28.45,13.07) ; v2(55.68,11.17) 56.05,11.17 U84.3 56.07,10.63 56.34,10.35 59.65,10.35 U108.6
  Bottom Layer w0.152: 11.56,27.48 5.89,27.48 5.03,28.34 5.03,37.79 5.71,38.47 8.86,38.47 9.25,38.85 11.53,38.85 12.53,37.86 20.86,37.86 22.19,36.53 22.19,31.76 23.93,30.02 v2(24.62,30.02) ; v2(55.68,11.17) 55.68,9.54 55.32,9.19 33.68,9.19 33.32,9.54 33.32,12.75 33,13.07 v2(28.45,13.07)
PB14: length 71.4
  Top Layer w0.152: v2(27.86,13.56) 27.86,22.27 29.88,24.28 U2.53 29.88,27.11 29.22,27.76 26.2,27.76 21.27,32.69 21.27,34.34 20.09,35.51 20.09,38.27 19.63,38.73 v2(18.05,38.73) ; U71.6 58.42,9.85 58.67,9.59 59.81,9.59 U108.7 ; 57.66,9.85 57.64,9.87 v2(57.18,9.87)
  Bottom Layer w0.152: v2(57.18,9.87) 56.16,9.87 55.98,9.69 55.98,9.08 55.73,8.83 33.38,8.83 33.02,9.19 33.02,12.23 32.66,12.59 28.23,12.59 27.86,12.95 v2(27.86,13.56) ; 18.06,38.73 R161.2
PB15: length 100.1
  Top Layer w0.152: U108.8 58.85,8.55 58.32,8.02 56.29,8.02 56.07,8.24 U71.3 56.57,8.55 v2(56.64,8.47) ; v2(27.39,12.64) 27.39,13.35 27.38,13.36 27.38,13.76 27.39,13.76 27.39,22.29 29.38,24.28 U2.54 29.38,26.74 28.82,27.3 26.11,27.3 22.56,30.86 v2(22.42,30.86)
  Bottom Layer w0.152: v2(27.39,12.64) 27.39,12.59 27.87,12.11 30.64,12.11 30.69,12.16 31.09,12.16 31.14,12.11 32.29,12.11 32.66,11.73 32.66,8.78 32.92,8.53 56.54,8.53 56.59,8.47 v2(56.64,8.47) ; 11.56,27.98 6.15,27.98 5.44,28.7 5.44,37.63 5.99,38.19 9.09,38.19 9.4,38.5 11.43,38.5 12.42,37.5 20.65,37.5 21.93,36.23 21.93,31.34 v2(22.42,30.86)
PC8: length 45.3
  Top Layer w0.152: U2.65 23.88,26.06 23.98,26.15
  Bottom Layer w0.152: 23.98,26.15 23.98,23.97 24.33,23.61 25.78,23.61 arc(25.91,23.56) 25.97,23.42 25.97,22.99 arc(26.16,22.8) 26.35,22.99 26.35,23.42 arc(26.41,23.56) 26.54,23.61 26.73,23.61 arc(26.87,23.56) 26.92,23.42 26.92,22.99 arc(27.11,22.8) 27.3,22.99 27.3,23.42 arc(27.36,23.56) 27.49,23.61 27.68,23.61 arc(27.82,23.56) 27.87,23.42 27.87,22.99 arc(28.06,22.8) 28.25,22.99 28.25,23.42 arc(28.31,23.56) 28.44,23.61 28.64,23.61 arc(28.77,23.56) 28.83,23.42 28.83,22.99 arc(29.02,22.8) 29.21,22.99 29.21,23.42 arc(29.26,23.56) 29.4,23.61 29.72,23.61 30.29,23.04 30.29,16.66 30.61,16.35 41.75,16.35 arc(41.88,16.3) 41.93,16.17 arc(41.98,16.05) 42.1,15.99 42.13,15.99 arc(42.26,16.05) 42.31,16.17 arc(42.36,16.3) 42.49,16.35 42.51,16.35 arc(42.64,16.3) 42.69,16.17 arc(42.74,16.05) 42.87,15.99 42.89,15.99 arc(43.02,16.05) 43.07,16.17 arc(43.12,16.3) 43.25,16.35 43.27,16.35 arc(43.4,16.3) 43.45,16.17 arc(43.5,16.05) 43.63,15.99 43.65,15.99 arc(43.78,16.05) 43.83,16.17 arc(43.88,16.3) 44.01,16.35 44.04,16.35 arc(44.16,16.3) 44.21,16.17 arc(44.27,16.05) 44.39,15.99 44.42,15.99 arc(44.54,16.05) 44.59,16.17 arc(44.65,16.3) 44.77,16.35 44.8,16.35 arc(44.92,16.3) 44.97,16.17 arc(45.03,16.05) 45.15,15.99 45.18,15.99 arc(45.3,16.05) 45.36,16.17 arc(45.41,16.3) 45.53,16.35 45.56,16.35 arc(45.69,16.3) 45.74,16.17 arc(45.79,16.05) 45.91,15.99 45.94,15.99 arc(46.07,16.05) 46.12,16.17 arc(46.17,16.3) 46.3,16.35 46.74,16.35 47.17,16.78 R145.1 47.31,17.42 CARD2.7
  vias: v2(23.98,26.25)
